# EasyEDA schematic MainPCB_Schematic_ETCautoPrikratki.json
TITLE: ETC autoPrikratki Main PCB; REV: 1.0; Date: 2024-10-18; Sheet: 1/1; Drawn By: Juraj Kolarić; Company: Udruga "Robofreak"
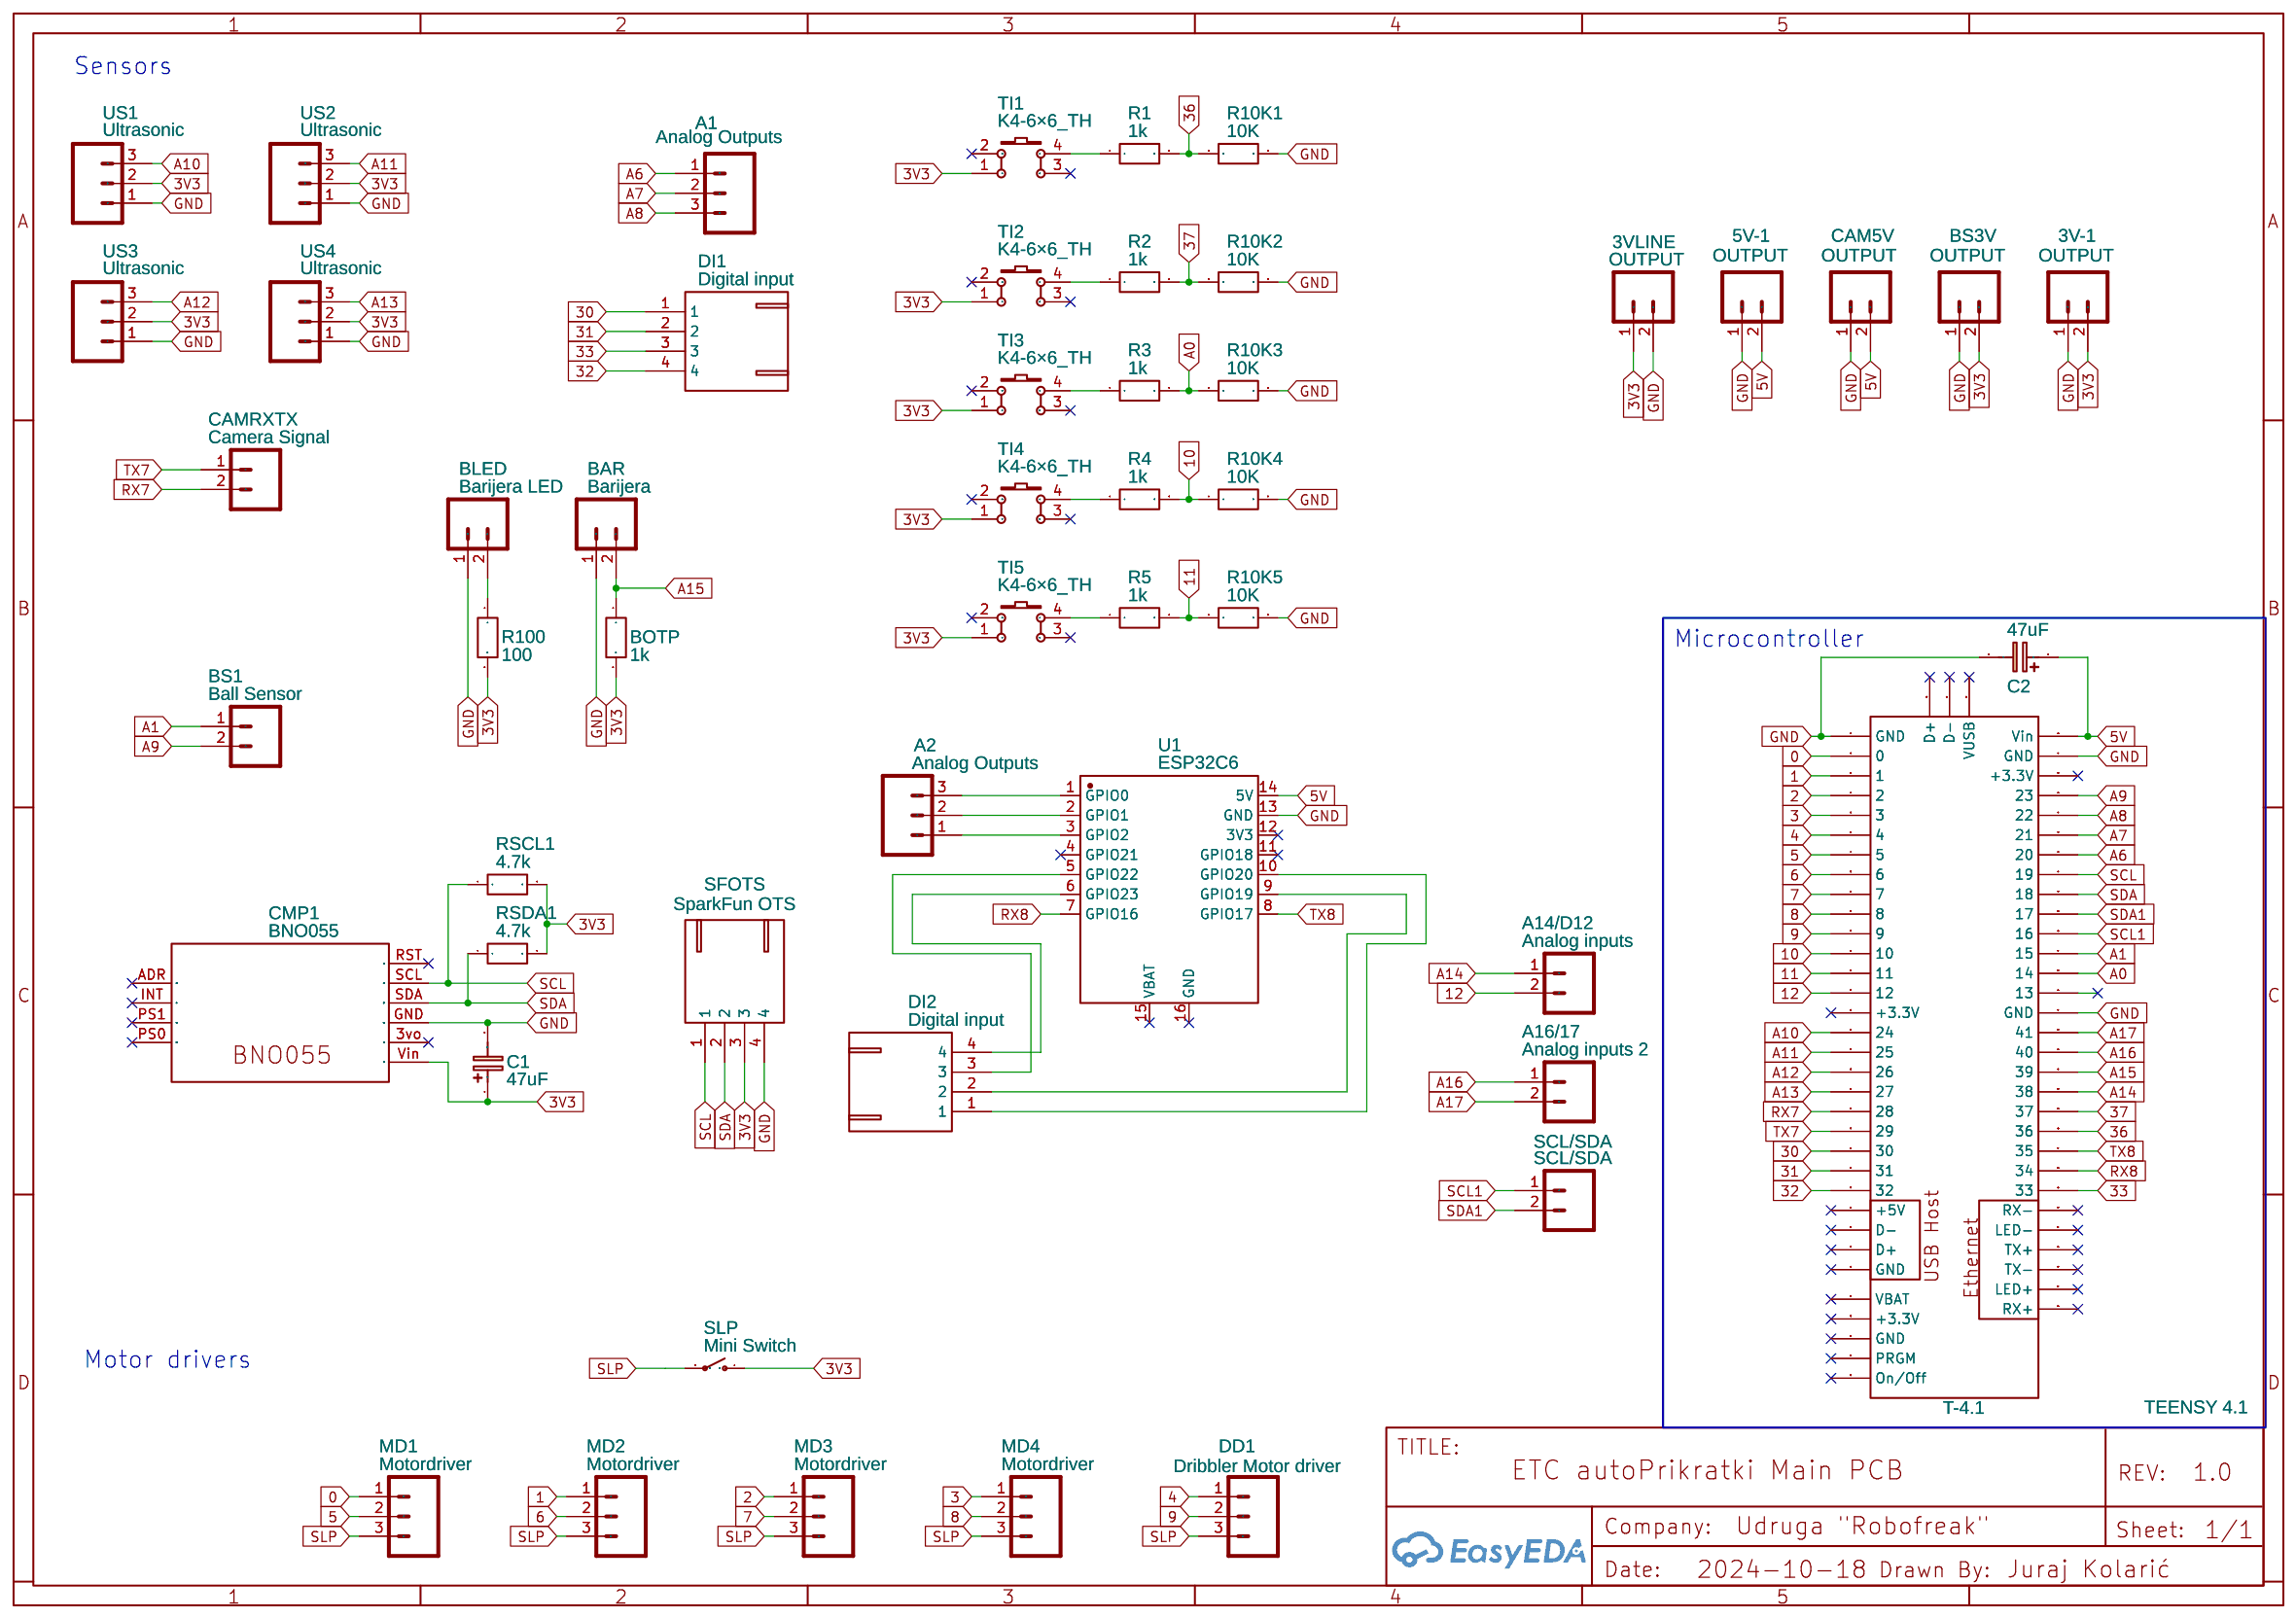
[diagram p0: schematic sheet]

## Parts
3V-1  OUTPUT  [JST_XH_1X02_2.50MM_THM]
3VLINE  OUTPUT  [JST_XH_1X02_2.50MM_THM]
5V-1  OUTPUT  [JST_XH_1X02_2.50MM_THM]
A1  Analog Outputs  [JST_XH_1X03_2.50MM_THM]
A2  Analog Outputs  [JST_XH_1X03_2.50MM_THM]
A14/D12  Analog inputs  [JST_XH_1X02_2.50MM_THM]
A16/17  Analog inputs 2  [JST_XH_1X02_2.50MM_THM]
BAR  Barijera  [JST_XH_1X02_2.50MM_THM]
BLED  Barijera LED  [JST_XH_1X02_2.50MM_THM]
BOTP  1k  [R_AXIAL-0.3]
BS1  Ball Sensor  [JST_XH_1X02_2.50MM_THM]
BS3V  OUTPUT  [JST_XH_1X02_2.50MM_THM]
C1  47uF  [CAP-D5.0×F2.0]
C2  47uF  [CAP-D5.0×F2.0]
CAM5V  OUTPUT  [JST_XH_1X02_2.50MM_THM]
CAMRXTX  Camera Signal  [JST_XH_1X02_2.50MM_THM]
CMP1  BNO055  [BNO055]
DD1  Dribbler Motor driver  [JST_XH_1X03_2.50MM_THM]
DI1  Digital input  [JST-XH-4-PIN]
DI2  Digital input  [JST-XH-4-PIN]
MD1  Motordriver  [JST_XH_1X03_2.50MM_THM]
MD2  Motordriver  [JST_XH_1X03_2.50MM_THM]
MD3  Motordriver  [JST_XH_1X03_2.50MM_THM]
MD4  Motordriver  [JST_XH_1X03_2.50MM_THM]
R1  1k  [R_AXIAL-0.3]
R2  1k  [R_AXIAL-0.3]
R3  1k  [R_AXIAL-0.3]
R4  1k  [R_AXIAL-0.3]
R5  1k  [R_AXIAL-0.3]
R10K1  10K  [R_AXIAL-0.3]
R10K2  10K  [R_AXIAL-0.3]
R10K3  10K  [R_AXIAL-0.3]
R10K4  10K  [R_AXIAL-0.3]
R10K5  10K  [R_AXIAL-0.3]
R100  100  [R_AXIAL-0.3]
RSCL1  4.7k  [R_AXIAL-0.3]
RSDA1  4.7k  [R_AXIAL-0.3]
SCL/SDA  SCL/SDA  [JST_XH_1X02_2.50MM_THM]
SFOTS  SparkFun OTS  [JST-XH-4-PIN]
SLP  Mini Switch  [MINI SPST TWO PINS]
T-4  TEENSY 4.1  [TEENSY-4.1-ALL-PINS]  (section 1)
TI1  K4-6×6_TH  [KEY-TH_4P-L6.0-W6.0-P4.50-LS6.5]
TI2  K4-6×6_TH  [KEY-TH_4P-L6.0-W6.0-P4.50-LS6.5]
TI3  K4-6×6_TH  [KEY-TH_4P-L6.0-W6.0-P4.50-LS6.5]
TI4  K4-6×6_TH  [KEY-TH_4P-L6.0-W6.0-P4.50-LS6.5]
TI5  K4-6×6_TH  [KEY-TH_4P-L6.0-W6.0-P4.50-LS6.5]
U1  ESP32C6  [XIAO_ESP32C6]
US1  Ultrasonic  [JST_XH_1X03_2.50MM_THM]
US2  Ultrasonic  [JST_XH_1X03_2.50MM_THM]
US3  Ultrasonic  [JST_XH_1X03_2.50MM_THM]
US4  Ultrasonic  [JST_XH_1X03_2.50MM_THM]

## Library data of the parts
3V-1 3VLINE 5V-1 A14/D12 A16/17 BAR BLED BS1 BS3V CAM5V CAMRXTX SCL/SDA = JST-XH-1X02-2.50MM-THM JS: sourceId: Y4gQNLJH3; Supplier Part: 455-2257-ND; Supplier: Digi-Key; Contributor: LucAce
A1 A2 DD1 MD1-MD4 US1-US4 = JST-XH-1X03-2.50MM-THM JS: sourceId: Y4gQNLJH3; Supplier Part: 455-2248-ND; Supplier: Digi-Key
BOTP R1-R5 R10K1-R10K5 R100 RSCL1 RSDA1 = R_AXIAL-0.3_EU: Contributor: LCEDA_Lib
C1 C2 = CE_TH_D5.0×F2.0_EU: Contributor: LCEDA_Lib
CMP1 = BNO055 COPY: Contributor: abdussamet28051999
DI1 DI2 SFOTS = JST-XH-4-Pin: Contributor: loyboy
SLP = Mini Switch: SPST Switch; Contributor: Rymo0987; Supplier: MPJA
T-4 = TEENSY 4.1 (ALL PINS): Contributor: purpleprawn
TI1-TI5 = K4-6×6_TH: Supplier: LCSC; Supplier Part: C136684; Manufacturer: 韩国韩荣; Manufacturer Part: K2-1102DP-E4SW-04; Contributor: LCEDA_Lib
U1 = ESP32C6: Contributor: losli

## Nets
3V3: 3V-1.2 3VLINE.1 BOTP.2 BS3V.2 C1.1 CMP1.Vin R100.2 RSCL1.2 RSDA1.2 SFOTS.3 SLP.1(O) TI1.1 TI2.1 TI3.1 TI4.1 TI5.1 US1.2 US2.2 US3.2 US4.2
5V: 5V-1.2 C2.1 CAM5V.2 T-4.48(+3.3V) U1.14(5V)
GND: 3V-1.1 3VLINE.2 5V-1.1 BAR.1 BLED.1 BS3V.1 C1.2 C2.2 CAM5V.1 CMP1.GND R10K1.2 R10K2.2 R10K3.2 R10K4.2 R10K5.2 SFOTS.4 T-4.1(GND) T-4.34(GND) T-4.47(VBAT) U1.13(GND) US1.1 US2.1 US3.1 US4.1
0: MD1.1 T-4.2(0)
1: MD2.1 T-4.3(1)
2: MD3.1 T-4.4(2)
3: MD4.1 T-4.5(3)
4: DD1.1 T-4.6(4)
5: MD1.2 T-4.7(5)
6: MD2.2 T-4.8(6)
7: MD3.2 T-4.9(7)
8: MD4.2 T-4.10(8)
9: DD1.2 T-4.11(9)
10: R4.2 R10K4.1 T-4.12(10)
11: R5.2 R10K5.1 T-4.13(11)
12: A14/D12.2 T-4.14(12)
30: DI1.1 T-4.22(30)
31: DI1.2 T-4.23(31)
32: DI1.4 T-4.24(32)
33: DI1.3 T-4.25(33)
36: R1.2 R10K1.1 T-4.28(36)
37: R2.2 R10K2.1 T-4.29(37)
A0: R3.2 R10K3.1 T-4.36(14)
A1: BS1.1 T-4.37(15)
A6: A1.1 T-4.42(GND)
A7: A1.2 T-4.43(D+)
A8: A1.3 T-4.44(D-)
A9: BS1.2 T-4.45(+5V)
A10: T-4.16(24) US1.3
A11: T-4.17(25) US2.3
A12: T-4.18(26) US3.3
A13: T-4.19(27) US4.3
A14: A14/D12.1 T-4.30(38)
A15: BAR.2 BOTP.1 T-4.31(39)
A16: A16/17.1 T-4.32(40)
A17: A16/17.2 T-4.33(41)
RX7: CAMRXTX.2 T-4.20(28)
RX8: T-4.26(34) U1.7(GPIO16)
SCL: CMP1.SCL RSCL1.1 SFOTS.1 T-4.41(19)
SCL1: SCL/SDA.1 T-4.38(16)
SDA: CMP1.SDA RSDA1.1 SFOTS.2 T-4.40(18)
SDA1: SCL/SDA.2 T-4.39(17)
SLP: DD1.3 MD1.3 MD2.3 MD3.3 MD4.3 SLP.2(P)
TX7: CAMRXTX.1 T-4.21(29)
TX8: T-4.27(35) U1.8(GPIO17)
Net-(A2-1): A2.1 U1.3(GPIO2)
Net-(A2-2): A2.2 U1.2(GPIO1)
Net-(A2-3): A2.3 U1.1(GPIO0)
Net-(BLED-2): BLED.2 R100.1
Net-(DI2-1): DI2.1 U1.10(GPIO20)
Net-(DI2-2): DI2.2 U1.9(GPIO19)
Net-(DI2-3): DI2.3 U1.5(GPIO22)
Net-(DI2-4): DI2.4 U1.6(GPIO23)
Net-(R1-1): R1.1 TI1.4
Net-(R2-1): R2.1 TI2.4
Net-(R3-1): R3.1 TI3.4
Net-(R4-1): R4.1 TI4.4
Net-(R5-1): R5.1 TI5.4

Not connected (* = marked no-connect by the designer): CMP1 3vo* ADR* INT* PS0* PS1* RST*; T-4 15(+3.3V)* 35(13) 46(+3.3V)* 49(GND)* 50(PRGM)* 51(On/Off)* 52(VUSB)* 60(RX+)* 61(LED+)* 62(TX-)* 63(TX+)* 64(LED-)* 65(RX-)* 66(D+)* 67(D-)*; TI1 2* 3*; TI2 2* 3*; TI3 2* 3*; TI4 2* 3*; TI5 2* 3*; U1 4(GPIO21)* 11(GPIO18)* 12(3V3)* 15(VBAT)* 16(GND)*

## Notes on the sheet
- Sensors
- Microcontroller
- Motor drivers
